# EAGLE design LiFePO4wered-USB (EAGLE 7.3.0)
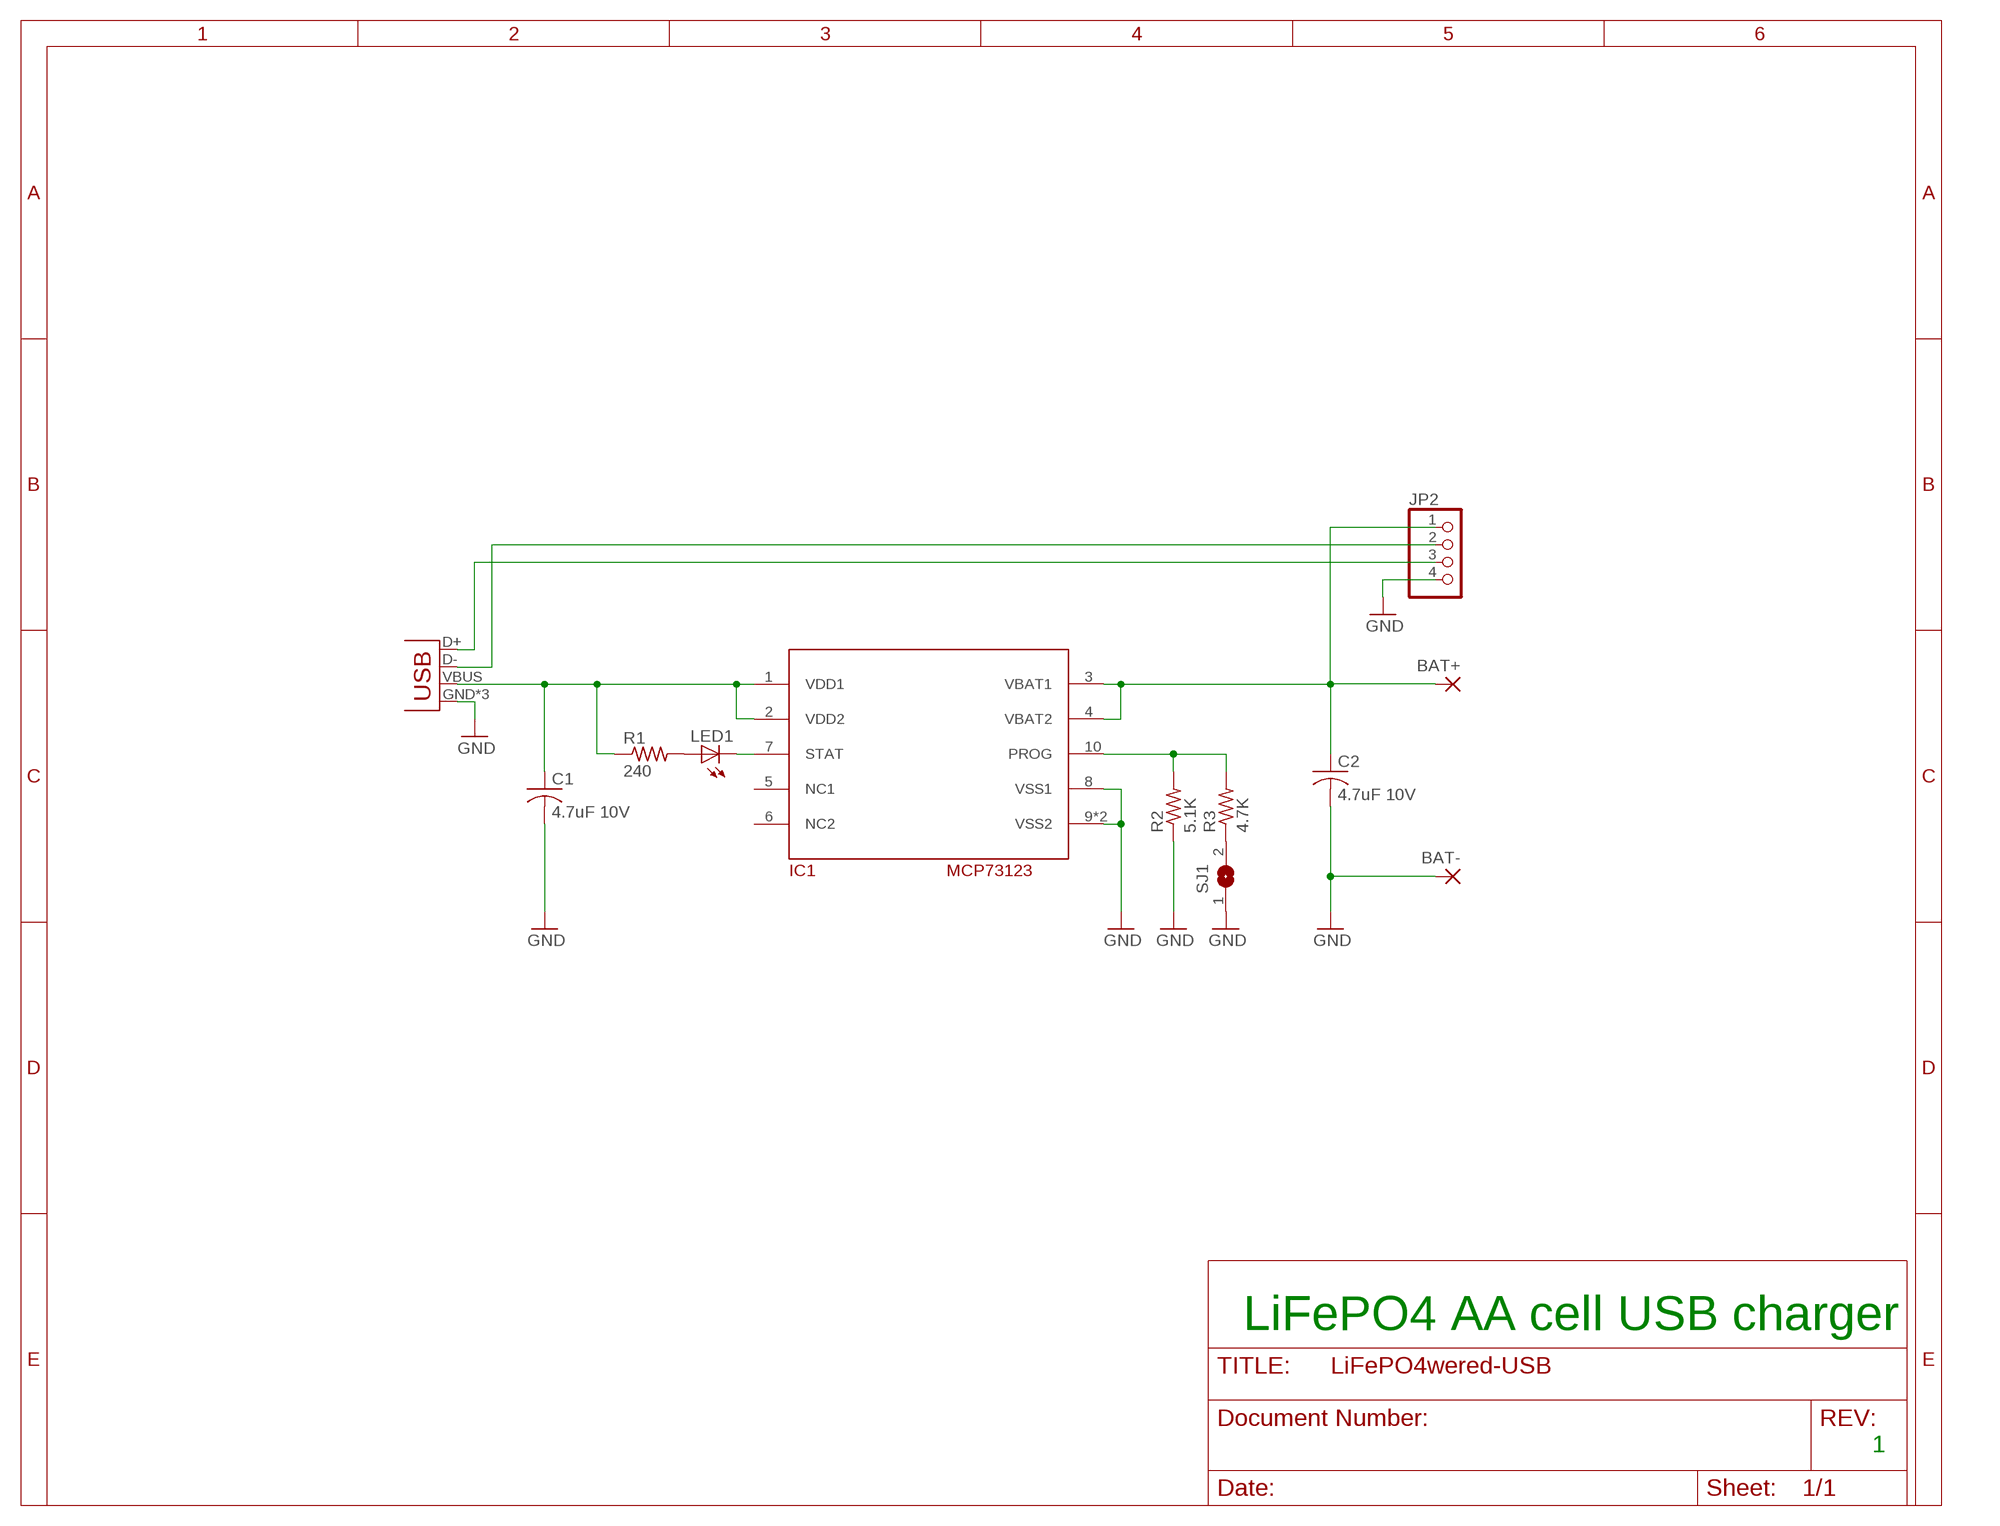
[diagram p0: schematic, sheet 1]

## Parts
BAT+  2,54/1,0  [2,54/1,0]
BAT-  2,54/1,0  [2,54/1,0]
C1  4.7uF 10V  C-USC0603  [C0603]
C2  4.7uF 10V  C-USC0603  [C0603]
IC1  MCP73123  [DFN10-3X3]
JP1  USB-MICROB  [USB-MICROB]
JP2  PINHD-1X4  [1X04]
LED1  LEDCHIP-LED0603  [CHIP-LED0603]
R1  240  R-US_R0603  [R0603]
R2  5.1K  R-US_R0603  [R0603]
R3  4.7K  R-US_R0603  [R0603]
SJ1  SJ  [SJ]

## Nets
GND: BAT-.1(P) C1.2 C2.2 IC1.8(VSS1) IC1.9(VSS2) IC1.EXP(VSS2) JP1.GND JP1.MT1(GND) JP1.MT2(GND) JP2.4 R2.1 SJ1.1
N$1: C1.1 IC1.1(VDD1) IC1.2(VDD2) JP1.VBUS R1.1
N$2: LED1.A R1.2
N$3: IC1.7(STAT) LED1.C
N$4: R3.1 SJ1.2
N$5: BAT+.1(P) C2.1 IC1.3(VBAT1) IC1.4(VBAT2) JP2.1
N$6: IC1.10(PROG) R2.2 R3.2
N$7: JP1.D- JP2.2
N$8: JP1.D+ JP2.3
Unconnected: IC1.5(NC1) IC1.6(NC2)

## Notes on the sheet
- LiFePO4 AA cell USB charger
- 1

## Library data of the parts
BAT+ BAT- = wirepad:2,54/1,0: THROUGH-HOLE PAD
C1 C2 = rcl:C-US: CAPACITOR, American symbol
IC1 = LiFePO4wer:MCP73123: MCP73123 LiFePO4 battery charger
JP1 = SparkFun-Connectors:USB: USB Connectors USB-B-PTH is fully proven SKU : PRT-00139/CONN-08278 USB-miniB is fully proven SKU : PRT-00587 USB-A-PCB is untested. USB-A-H is throughly reviewed, but untested. Spark Fun Electronics SKU : PRT-00437 USB-B-SMT is throughly reviewed, but untested. Needs silkscreen touching up. USB-A-S has not been used/tested USB-MB-H has not been used/tested USB-MICROB has been used. CONN-09505; PROD_ID: CONN-09505
JP2 = pinhead:PINHD-1X4: PIN HEADER
LED1 = led:LED: LED OSRAM: - CHIPLED LG R971, LG N971, LY N971, LG Q971, LY Q971, LO R971, LY R971 LH N974, LH R974 LS Q976, LO Q976, LY Q976 LO Q996 - Hyper CHIPLED LW Q18S LB Q993, LB Q99A, LB R99A - SideLED LS A670, LO A670, LY A670, LG A670, LP A670 LB A673, LV A673, LT A673, LW A673 LH A674 LY A675 LS A676, LA A676, LO A676, LY A676, LW A676 LS A679, LY A679, LG A679 - Hyper Micro SIDELED® LS Y876, LA Y876, LO Y876, LY Y876 LT Y87S - SmartLED LW L88C, LW L88S LB L89C, LB L89S, LG L890 LS L89K, LO L89K, LY L89K LS L896, LA L896, LO L896, LY L896 - TOPLED LS T670, LO T670, LY T670, LG T670, LP T670 LSG T670, LSP T670, LSY T670, LOP T670, LYG T670 LG T671, LOG T671, LSG T671 LB T673, LV T673, LT T673, LW T673 LH T674 LS T676, LA T676, LO T676, LY T676, LB T676, LH T676, LSB T676, LW T676 LB T67C, LV T67C, LT T67C, LS T67K, LO T67K, LY T67K, LW E67C LS E67B, LA E67B, LO E67B, LY E67B, LB E67C, LV E67C, LT E67C LW T67C LS T679, LY T679, LG T679 LS T770, LO T770, LY T770, LG T770, LP T770 LB T773, LV T773, LT T773, LW T773 LH T774 LS E675, LA E675, LY E675, LS T675 LS T776, LA T776, LO T776, LY T776, LB T776 LHGB T686 LT T68C, LB T68C - Hyper Mini TOPLED® LB M676 - Mini TOPLED Santana® LG M470 LS M47K, LO M47K, LY M47K Source: http://www.osram.convergy.de LUXEON: - LUMILED® LXK2-PW12-R00, LXK2-PW12-S00, LXK2-PW14-U00, LXK2-PW14-V00 LXK2-PM12-R00, LXK2-PM12-S00, LXK2-PM14-U00 LXK2-PE12-Q00, LXK2-PE12-R00, LXK2-PE12-S00, LXK2-PE14-T00, LXK2-PE14-U00 LXK2-PB12-K00, LXK2-PB12-L00, LXK2-PB12-M00, LXK2-PB14-N00, LXK2-PB14-P00, LXK2-PB14-Q00 LXK2-PR12-L00, LXK2-PR12-M00, LXK2-PR14-Q00, LXK2-PR14-R00 LXK2-PD12-Q00, LXK2-PD12-R00, LXK2-PD12-S00 LXK2-PH12-R00, LXK2-PH12-S00 LXK2-PL12-P00, LXK2-PL12-Q00, LXK2-PL12-R00 Source: www.luxeon.com KINGBRIGHT: KA-3528ASYC Source: www.kingbright.com
R1-R3 = rcl:R-US_: RESISTOR, American symbol
SJ1 = jumper:SJ: SMD solder JUMPER

## Board
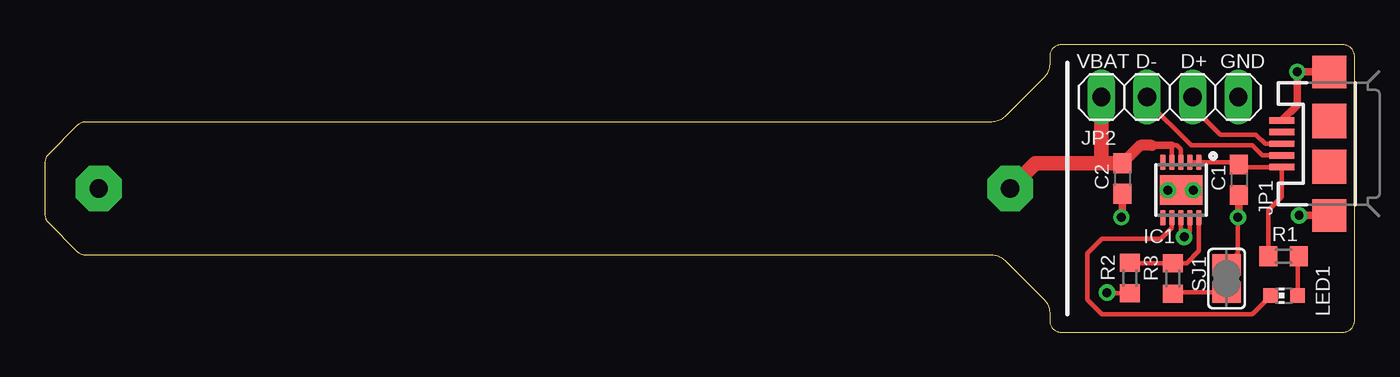
[diagram p1: board, top side]
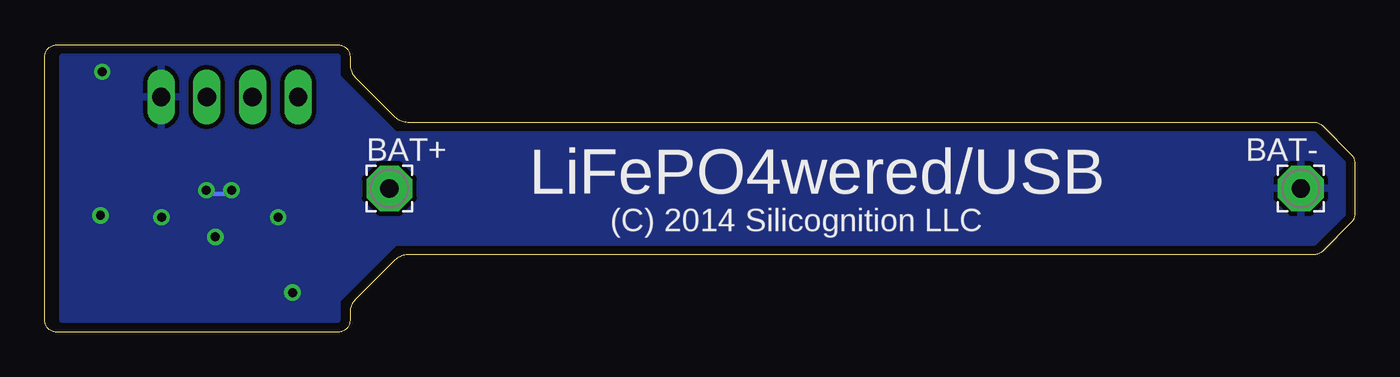
[diagram p2: board, bottom side, seen from below]

Size 73 x 16 mm. Coordinates in mm from the lower left corner, seen from the top.
Outline: 56,15.37 56,14.91 arc-45 55.71,14.21 53.49,11.99 arc-45 52.79,11.7 2.26,11.7 arc45 1.81,11.51 0.19,9.89 arc45 0,9.44 0,6.56 arc45 0.19,6.11 1.81,4.49 arc45 2.26,4.3 52.79,4.3 arc-45 53.49,4.01 55.71,1.79 arc-45 56,1.09 56,0.64 arc90 56.63,0 72.36,0 arc90 73,0.64 73,15.37 arc90 72.36,16 56.63,16 arc90 56,15.37
Copper layers (1*16): Top 0.035mm / dielectric 1.5mm / Bottom 0.035mm
Design rules "default *": minimum track width 6mil, minimum drill 13mil, track to track 6mil, track to pad 6mil, pad to pad 6mil, via to via 6mil, smd to smd 6mil, copper to edge 15mil, drill to drill 8mil, minimum pad ring 10mil, minimum via ring 8mil, stop-mask expansion 4mil, vias tented up to drill 0mil, thermal gap 10mil

### Footprints (pad centres in the part's own frame; a part is rotated, then mirrored left to right if it is on the bottom)
2,54/1,0 = drill 1.016 pad 2.54 octagon: 1 0,0
C0603 = smd 1.1 x 1: 1 -0.85,0; 2 0.85,0
DFN10-3X3 = smd 0.3 x 0.85: 1 -1,-1.55; 2 -0.5,-1.55; 3 0,-1.55; 4 0.5,-1.55; 5 1,-1.55; 6 1,1.55; 7 0.5,1.55; 8 0,1.55; 9 -0.5,1.55; 10 -1,1.55 | smd 2.38 x 1.65: EXP 0,0
USB-MICROB = smd 0.35 x 1.4: D+ 0,2.65; D- -0.65,2.65; GND 1.3,2.65; ID 0.65,2.65; VBUS -1.3,2.65 | smd 1.8 x 1.9: MT1 -4,0; MT2 4,0 | smd 1.9 x 1.9: P$1 -1.27,0; P$2 1.27,0
1X04 = drill 1.016 long: 1 -3.81,0; 2 -1.27,0; 3 1.27,0; 4 3.81,0
CHIP-LED0603 = smd 0.8 x 0.8: A 0,-0.75; C 0,0.75
R0603 = smd 1 x 1.1: 1 -0.85,0; 2 0.85,0
SJ = smd 1.168 x 1.6: 1 -0.762,0; 2 0.762,0

### Placement (x,y rotation side)
BAT+  53.8,8 0 bottom
BAT-  3,8 0 bottom
C1  66.55,8.49 270 top
C2  60.05,8.55 270 top
IC1  63.32,7.92 180 top
JP1  71.59,10.49 90 top
JP2  62.7,13.1 0 top
LED1  69.07,2.03 90 top
R1  69.03,4.23 0 top
R2  60.47,3.01 90 top
R3  62.87,2.99 90 top
SJ1  65.86,2.98 270 top

### Tracks (layer width: path | path; a pad name or v marks a point on that pad's centre or on a via)
GND  (via drill 0.5)
  Top 0.254: IC1.8 63.32,5.48 v63.5,5.3 63.82,5.62 IC1.9 | SJ1.1 66.5,4.38 v66.5,6.4 | JP1.MT1 | R2.1 59.24,2.16 v59.2,2.2 | IC1.EXP 62.62,7.92 v62.6,7.9 | v64,7.9 64,7.8 63.9,7.7
  Top 0.406: v66.5,6.4 66.55,6.45 C1.2 | C2.2 60.05,6.45 v60,6.4 | JP1.MT2 v69.81,14.49 v69.8,14.5 69.8,12.65 JP1.GND | JP1.MT1 v69.9,6.5
  Bottom 0.254: v63.5,5.3 63.6,5.2 | v69.9,6.5 69.9,6.3 | v59.2,2.2 59.2,2 | v62.6,7.9 62.6,7.8 62.7,7.7 63.8,7.7 v64,7.9
  Bottom 0.406: v66.5,6.4 66.6,6.4 66.7,6.3 | v60,6.4 60.2,6.2 | v69.8,14.5 69.8,14.4
  pour Bottom (isolate 0.254): 0.7,9.4 2.3,11 53.5,11 56.7,14.2 56.7,15.3 72,15.3 72,0.7 56.7,0.7 56.7,1.8 53.5,5 2.3,5 0.7,6.6
N$1
  Top 0.254: 66.8,9.19 C1.1 | IC1.2 IC1.1 66.52,9.47 C1.1 | R1.1 68.18,6.78 68.94,7.54 JP1.VBUS 66.7,9.19 C1.1
N$2
  Top 0.254: R1.2 69.82,4.17 LED1.A
N$3
  Top 0.254: LED1.C 67.29,1 58.9,1 58.1,1.8 58.1,4.4 58.9,5.2 62.2,5.2 62.82,5.82 IC1.7
N$4
  Top 0.254: R3.1 62.95,2.22 SJ1.2
N$5
  Top 0.254: IC1.4 62.82,10.38 62.8,10.4 | IC1.3 63.32,10.18 63.1,10.4 62.4,10.4
  Top 0.406: 61.7,10.4 62.4,10.4 62.8,10.4
  Top 0.6: 61.7,10.4 61.05,10.4 C2.1
  Top 0.813: BAT+.1 55.2,9.4 58.8,9.4 | 58.8,9.4 C2.1 | JP2.1 58.89,9.49 58.8,9.4
N$6
  Top 0.254: R2.2 60.49,3.84 R3.2 63.64,3.84 64.32,4.52 IC1.10
N$7
  Top 0.254: JP1.D- 67.86,9.84 67.3,10.4 63.9,10.4 61.43,12.87 JP2.2
N$8
  Top 0.254: JP1.D+ 68.01,10.49 67.5,11 65.5,11 63.97,12.53 JP2.3

### Text on the board
tPlace: VBAT | D- | D+ | GND
bPlace: LiFePO4wered/USB | (C) 2014 Silicognition LLC